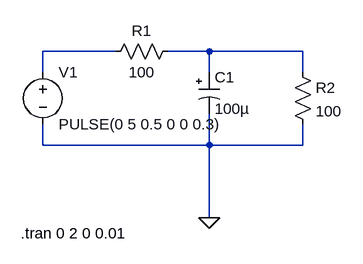
[diagram p0: schematic resetCircuit.asc]
resetCircuit.asc, the LTspice schematic file:
Version 4
SHEET 1 880 680
WIRE 112 144 0 144
WIRE 256 144 192 144
WIRE 400 144 256 144
WIRE 0 176 0 144
WIRE 256 176 256 144
WIRE 400 176 400 144
WIRE 0 288 0 256
WIRE 256 288 256 240
WIRE 256 288 0 288
WIRE 400 288 400 256
WIRE 400 288 256 288
WIRE 256 400 256 288
FLAG 256 400 0
SYMBOL res 208 128 R90
WINDOW 0 0 56 VBottom 2
WINDOW 3 32 56 VTop 2
SYMATTR InstName R1
SYMATTR Value 100
SYMBOL res 384 160 R0
SYMATTR InstName R2
SYMATTR Value 100
SYMBOL voltage 0 160 R0
WINDOW 123 0 0 Left 0
WINDOW 39 0 0 Left 0
SYMATTR InstName V1
SYMATTR Value PULSE(0 5 0.5 0 0 0.3)
SYMBOL polcap 240 176 R0
WINDOW 3 24 56 Left 2
SYMATTR InstName C1
SYMATTR Value 100µ
SYMATTR Description Capacitor
SYMATTR Type cap
SYMATTR SpiceLine V=8 Irms=2.21565 Rser=0.055 Lser=0
TEXT -34 424 Left 2 !.tran 0 2 0 0.01

The netlist it stands for:
* resetCircuit.asc
R1 N002 N001 100
R2 N002 0 100
V1 N001 0 PULSE(0 5 0.5 0 0 0.3)
C1 N002 0 100µ V=8 Irms=2.21565 Rser=0.055 Lser=0
.tran 0 2 0 0.01
.backanno
.end